# EAGLE design dist_sensor (EAGLE 7.1.0)
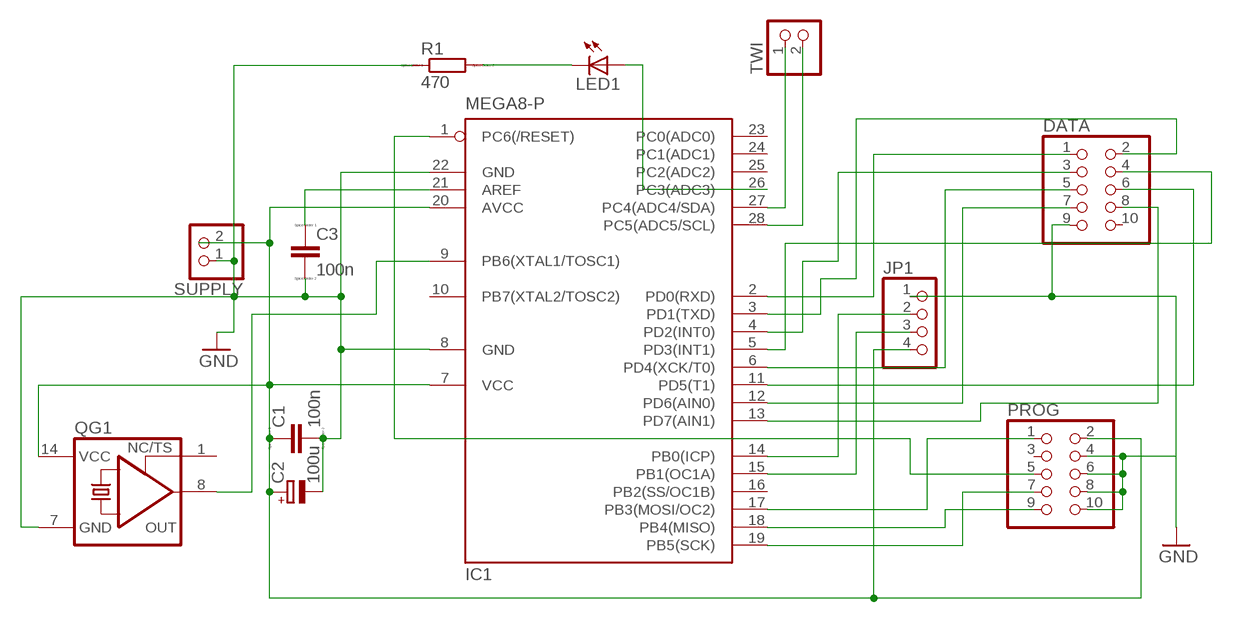
[diagram p0: schematic, sheet 1]

## Parts
C1  100n  C-EU025-025X050  [C025-025X050]
C2  100u  CPOL-EUE5-8.5  [E5-8,5]
C3  100n  C-EU025-025X050  [C025-025X050]
DATA  PINHD-2X5  [2X05]
IC1  MEGA8-P  [DIL28-3]
JP1  PINHD-1X4  [1X04]
LED1  LED5MM  [LED5MM]
PROG  PINHD-2X5  [2X05]
QG1  XO-14  [DIL14S]
R1  470  R-EU_0207_10  [0207/10]
SUPPLY  PINHD-1X2  [1X02]
TWI  PINHD-1X2  [1X02]

## Nets
GND: C1.2 C2.- C3.2 DATA.9 IC1.8(GND) IC1.22(GND) JP1.1 PROG.4 PROG.6 PROG.8 PROG.10 QG1.7(GND) R1.1 SUPPLY.1
N$1: IC1.17(PB3(MOSI/OC2)) PROG.1
N$2: IC1.18(PB4(MISO)) PROG.9
N$3: IC1.19(PB5(SCK)) PROG.7
N$4: C1.1 C2.+ IC1.7(VCC) IC1.20(AVCC) JP1.4 PROG.2 QG1.14(VCC) SUPPLY.2
N$5: IC1.1(PC6(/RESET)) PROG.5
N$6: DATA.1 IC1.2(PD0(RXD))
N$7: DATA.2 IC1.3(PD1(TXD))
N$8: IC1.27(PC4(ADC4/SDA)) TWI.1
N$9: DATA.4 IC1.5(PD3(INT1))
N$10: DATA.3 IC1.4(PD2(INT0))
N$11: DATA.5 IC1.6(PD4(XCK/T0))
N$12: DATA.6 IC1.11(PD5(T1))
N$13: DATA.8 IC1.13(PD7(AIN1))
N$14: IC1.14(PB0(ICP)) JP1.2
N$15: DATA.7 IC1.12(PD6(AIN0))
N$16: IC1.15(PB1(OC1A)) JP1.3
N$17: C3.1 IC1.21(AREF)
N$18: IC1.9(PB6(XTAL1/TOSC1)) QG1.8(OUT)
N$19: IC1.28(PC5(ADC5/SCL)) TWI.2
N$20: IC1.26(PC3(ADC3)) LED1.A
N$21: LED1.K(C) R1.2
Unconnected: DATA.10 IC1.10(PB7(XTAL2/TOSC2)) IC1.16(PB2(SS/OC1B)) IC1.23(PC0(ADC0)) IC1.24(PC1(ADC1)) IC1.25(PC2(ADC2)) PROG.3 QG1.1(TS)

## Library data of the parts
C1 C3 = resistor:C-EU: CAPACITOR, European symbol; SPICEPREFIX: C
C2 = resistor:CPOL-EU: POLARIZED CAPACITOR, European symbol
DATA PROG = pinhead:PINHD-2X5: PIN HEADER
IC1 = atmel:MEGA8-P: MICROCONTROLLER 8 Kbytes FLASH, 1 kbytes SRAM, 512 bytes EEPROM, USART, 4-channel 10 bit ADC, 2-channel 8 bit ADC Pin compatible with Atmega48, ATMega88, ATMega168 Source: avr.lbr; OC_FARNELL: unknown; OC_NEWARK: unknown
JP1 = pinhead:PINHD-1X4: PIN HEADER
LED1 = led:LED: LED OSRAM: - CHIPLED LG R971, LG N971, LY N971, LG Q971, LY Q971, LO R971, LY R971 LH N974, LH R974 LS Q976, LO Q976, LY Q976 LO Q996 - Hyper CHIPLED LW Q18S LB Q993, LB Q99A, LB R99A - SideLED LS A670, LO A670, LY A670, LG A670, LP A670 LB A673, LV A673, LT A673, LW A673 LH A674 LY A675 LS A676, LA A676, LO A676, LY A676, LW A676 LS A679, LY A679, LG A679 - Hyper Micro SIDELED® LS Y876, LA Y876, LO Y876, LY Y876 LT Y87S - SmartLED LW L88C, LW L88S LB L89C, LB L89S, LG L890 LS L89K, LO L89K, LY L89K LS L896, LA L896, LO L896, LY L896 - TOPLED LS T670, LO T670, LY T670, LG T670, LP T670 LSG T670, LSP T670, LSY T670, LOP T670, LYG T670 LG T671, LOG T671, LSG T671 LB T673, LV T673, LT T673, LW T673 LH T674 LS T676, LA T676, LO T676, LY T676, LB T676, LH T676, LSB T676, LW T676 LB T67C, LV T67C, LT T67C, LS T67K, LO T67K, LY T67K, LW E67C LS E67B, LA E67B, LO E67B, LY E67B, LB E67C, LV E67C, LT E67C LW T67C LS T679, LY T679, LG T679 LS T770, LO T770, LY T770, LG T770, LP T770 LB T773, LV T773, LT T773, LW T773 LH T774 LS E675, LA E675, LY E675, LS T675 LS T776, LA T776, LO T776, LY T776, LB T776 LHGB T686 LT T68C, LB T68C - Hyper Mini TOPLED® LB M676 - Mini TOPLED Santana® LG M470 LS M47K, LO M47K, LY M47K Source: http://www.osram.convergy.de LUXEON: - LUMILED® LXK2-PW12-R00, LXK2-PW12-S00, LXK2-PW14-U00, LXK2-PW14-V00 LXK2-PM12-R00, LXK2-PM12-S00, LXK2-PM14-U00 LXK2-PE12-Q00, LXK2-PE12-R00, LXK2-PE12-S00, LXK2-PE14-T00, LXK2-PE14-U00 LXK2-PB12-K00, LXK2-PB12-L00, LXK2-PB12-M00, LXK2-PB14-N00, LXK2-PB14-P00, LXK2-PB14-Q00 LXK2-PR12-L00, LXK2-PR12-M00, LXK2-PR14-Q00, LXK2-PR14-R00 LXK2-PD12-Q00, LXK2-PD12-R00, LXK2-PD12-S00 LXK2-PH12-R00, LXK2-PH12-S00 LXK2-PL12-P00, LXK2-PL12-Q00, LXK2-PL12-R00 Source: www.luxeon.com KINGBRIGHT: KA-3528ASYC Source: www.kingbright.com
QG1 = crystal:XO-: CRYSTAL; OC_FARNELL: unknown; OC_NEWARK: unknown
R1 = resistor:R-EU_: RESISTOR, European symbol; SPICEPREFIX: R
SUPPLY TWI = pinhead:PINHD-1X2: PIN HEADER

## Board
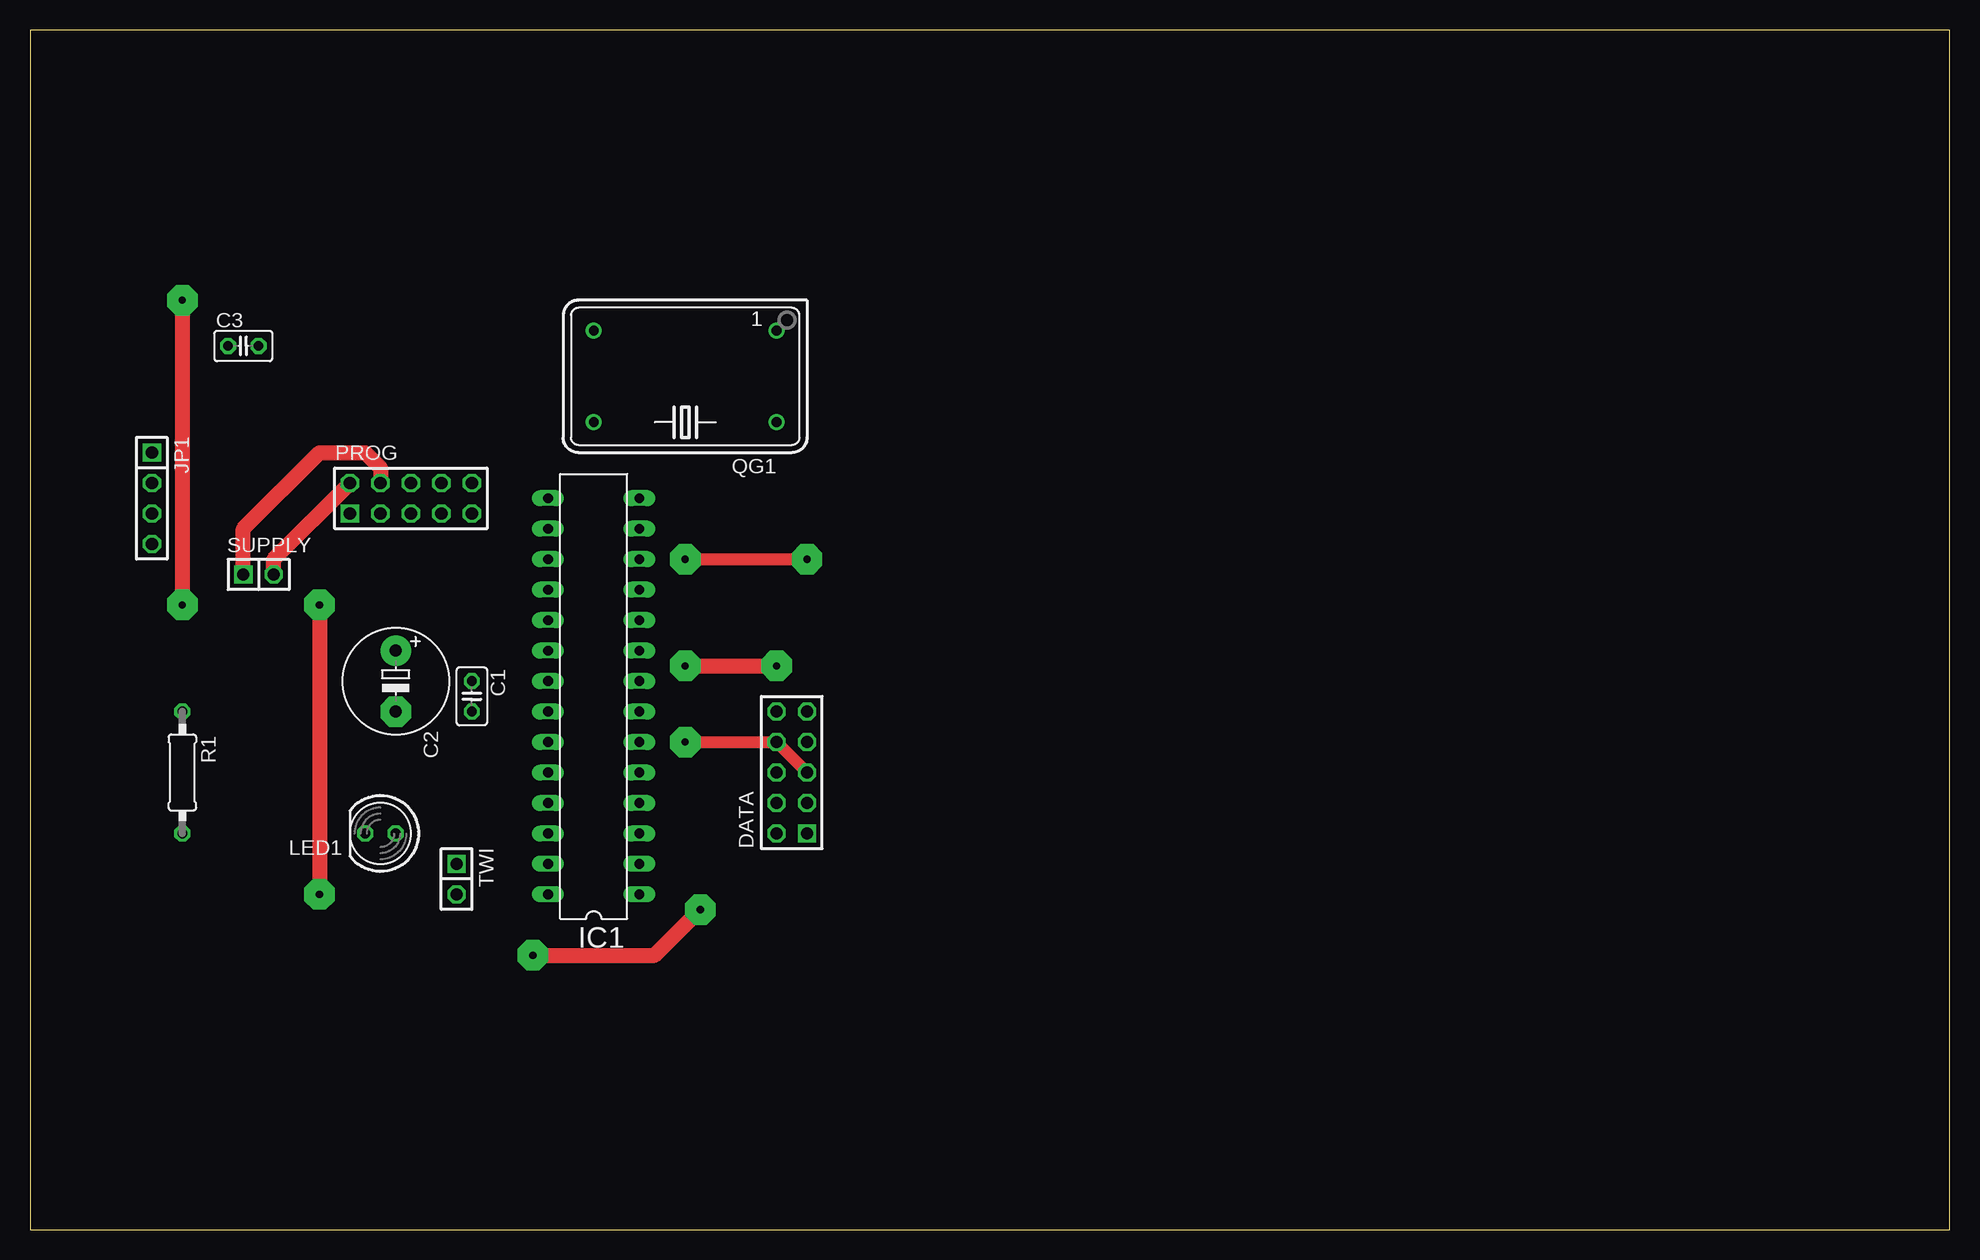
[diagram p1: board, top side]
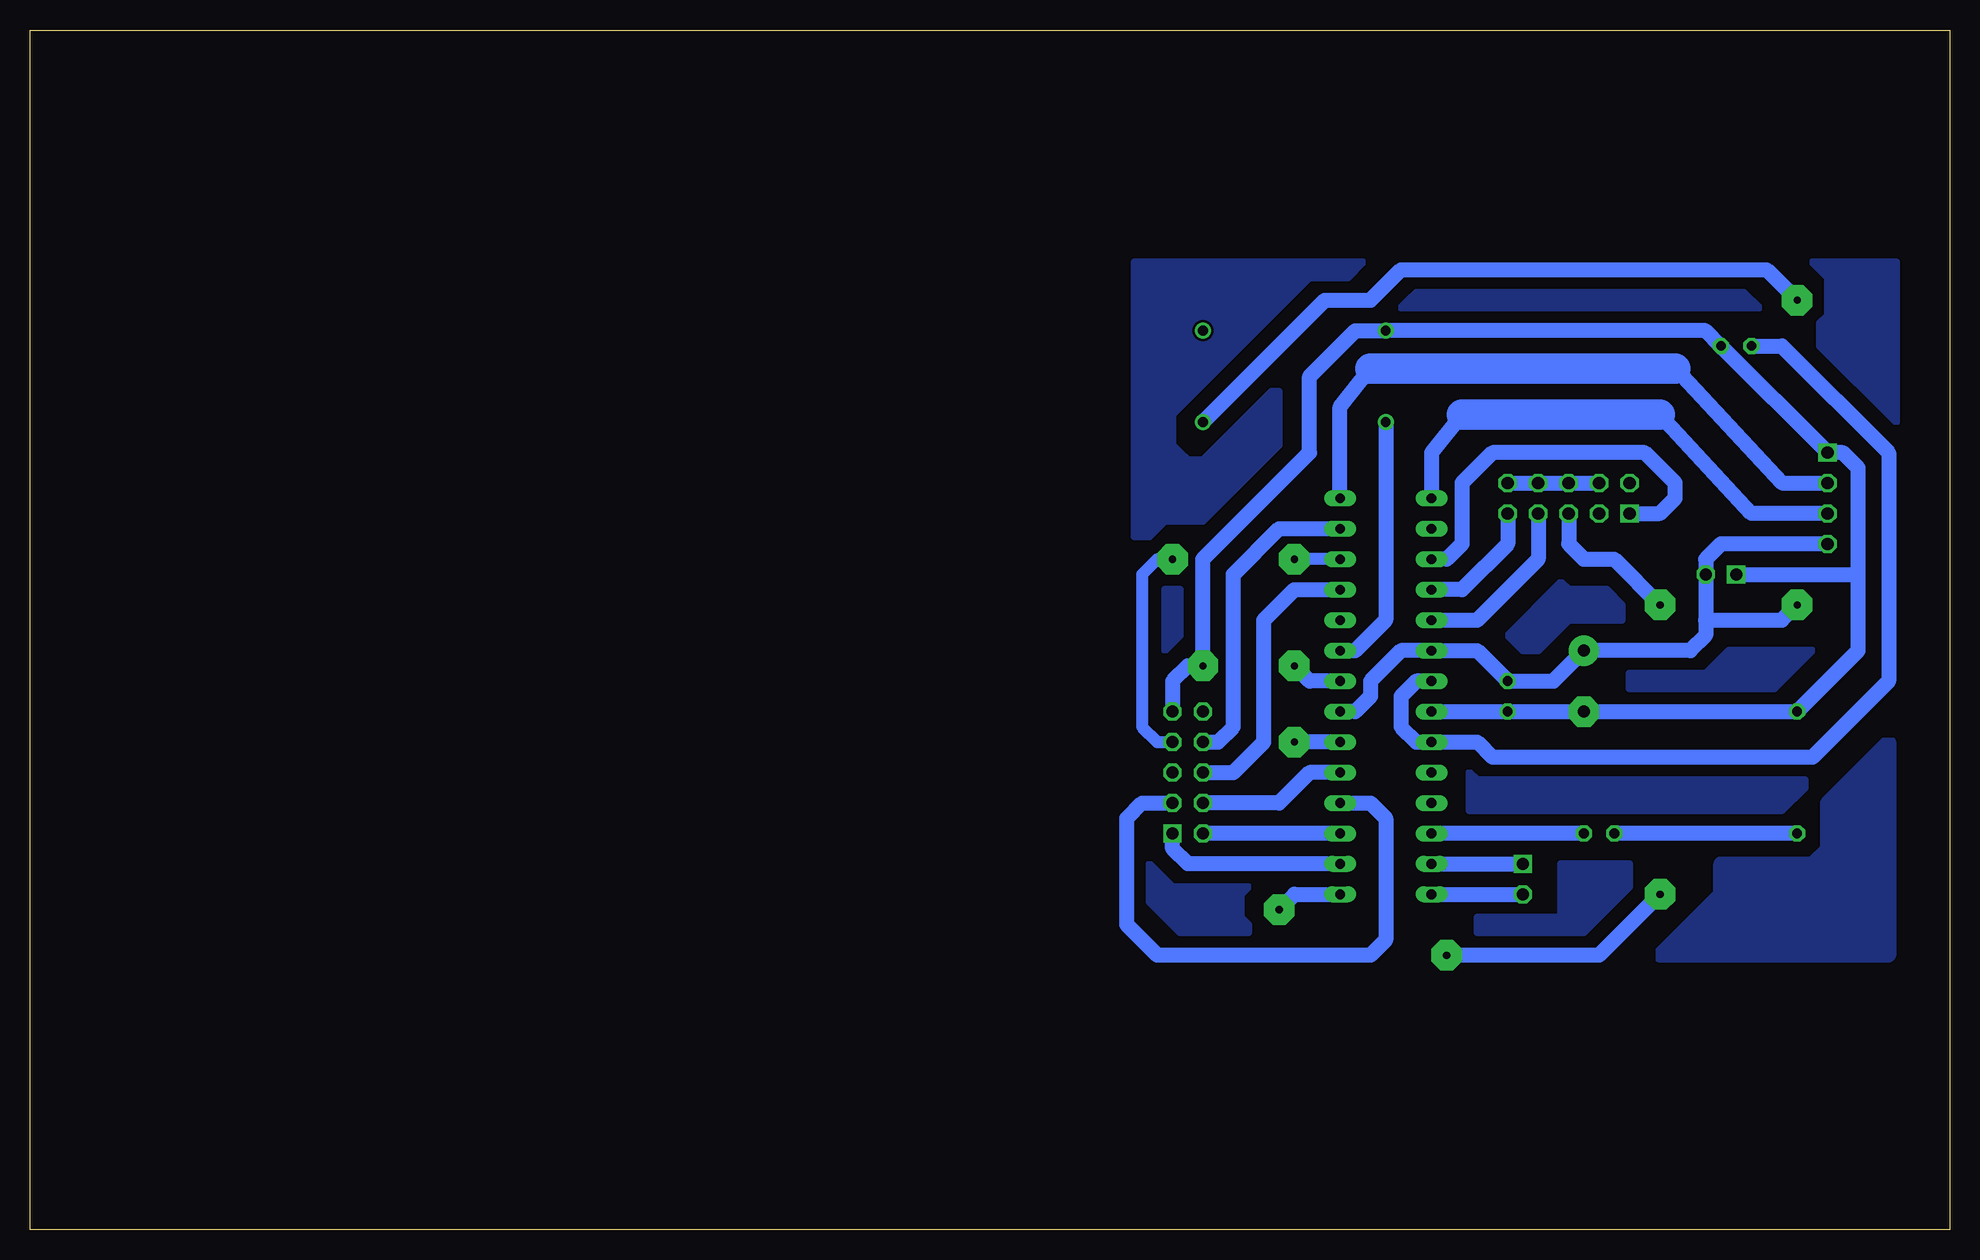
[diagram p2: board, bottom side, seen from below]

Size 160 x 100 mm. Coordinates in mm from the lower left corner, seen from the top.
Outline: 0,0 160,0 160,100 0,100 0,0
Copper layers (1*16): Top 0.035mm / dielectric 1.5mm / Bottom 0.035mm
Design rules "default": minimum track width 10mil, minimum drill 24mil, track to track 8mil, track to pad 8mil, pad to pad 8mil, via to via 8mil, smd to smd 8mil, copper to edge 40mil, drill to drill 8mil, minimum pad ring 10mil, minimum via ring 8mil, stop-mask expansion 4mil, vias tented up to drill 0mil, thermal gap 10mil

### Footprints (pad centres in the part's own frame; a part is rotated, then mirrored left to right if it is on the bottom)
C025-025X050 = drill 0.813 octagon: 1 -1.27,0; 2 1.27,0
E5-8,5 = drill 1.016 pad 2.54: + -2.54,0 | drill 1.016 pad 2.54 octagon: - 2.54,0
2X05 = drill 1.016 square: 1 -5.08,-1.27 | drill 1.016 octagon: 2 -5.08,1.27; 3 -2.54,-1.27; 4 -2.54,1.27; 5 0,-1.27; 6 0,1.27; 7 2.54,-1.27; 8 2.54,1.27; 9 5.08,-1.27; 10 5.08,1.27
DIL28-3 = drill 0.813 long: 1 -16.51,-3.81; 2 -13.97,-3.81; 3 -11.43,-3.81; 4 -8.89,-3.81; 5 -6.35,-3.81; 6 -3.81,-3.81; 7 -1.27,-3.81; 8 1.27,-3.81; 9 3.81,-3.81; 10 6.35,-3.81; 11 8.89,-3.81; 12 11.43,-3.81; 13 13.97,-3.81; 14 16.51,-3.81; 15 16.51,3.81; 16 13.97,3.81; 17 11.43,3.81; 18 8.89,3.81; 19 6.35,3.81; 20 3.81,3.81; 21 1.27,3.81; 22 -1.27,3.81; 23 -3.81,3.81; 24 -6.35,3.81; 25 -8.89,3.81; 26 -11.43,3.81; 27 -13.97,3.81; 28 -16.51,3.81
1X04 = drill 1.016 square: 1 -3.81,0 | drill 1.016 octagon: 2 -1.27,0; 3 1.27,0; 4 3.81,0
LED5MM = drill 0.813 octagon: A -1.27,0; K 1.27,0
DIL14S = drill 0.813: 1 -7.62,-3.81; 7 7.62,-3.81; 8 7.62,3.81; 14 -7.62,3.81
0207/10 = drill 0.813 octagon: 1 -5.08,0; 2 5.08,0
1X02 = drill 1.016 square: 1 -1.27,0 | drill 1.016 octagon: 2 1.27,0

### Placement (x,y rotation side)
C1  36.83,44.45 270 top
C2  30.48,45.72 270 top
C3  17.78,73.66 0 top
DATA  63.5,38.1 90 top
IC1  46.99,44.45 90 top
JP1  10.16,60.96 270 top
LED1  29.21,33.02 180 top
PROG  31.75,60.96 0 top
QG1  54.61,71.12 180 top
R1  12.7,38.1 270 top
SUPPLY  19.05,54.61 0 top
TWI  35.56,29.21 270 top

### Tracks (layer width: path | path; a pad name or v marks a point on that pad's centre or on a via)
GND  (via drill 0.6 pad 2.54)
  Top 1.27: v54.61,46.99 v62.23,46.99 | SUPPLY.1 17.78,58.42 24.13,64.77 27.94,64.77 29.21,63.5 PROG.4
  Bottom 1.27: IC1.22 C1.2 C2.- R1.1 7.62,48.26 7.62,54.61 | IC1.8 53.34,45.72 v54.61,46.99 | DATA.9 64.77,45.72 63.5,46.99 v62.23,46.99 62.23,55.88 53.34,64.77 53.34,71.12 49.53,74.93 QG1.7 20.32,74.93 C3.2 JP1.1 8.89,64.77 7.62,63.5 7.62,54.61 | SUPPLY.1 7.62,54.61 | PROG.10 PROG.8 PROG.6 PROG.4
N$1
  Bottom 1.27: PROG.1 24.13,59.69 22.86,60.96 22.86,62.23 25.4,64.77 38.1,64.77 40.64,62.23 40.64,57.15 41.91,55.88 IC1.17
N$2
  Bottom 1.27: PROG.9 36.83,57.15 40.64,53.34 IC1.18
N$3
  Bottom 1.27: IC1.19 39.37,50.8 34.29,55.88 PROG.7
N$4  (via drill 0.6 pad 2.54)
  Top 1.27: v12.7,77.47 v12.7,52.07 | SUPPLY.2 20.32,55.88 PROG.2
  Bottom 1.27: JP1.4 19.05,57.15 20.32,55.88 SUPPLY.2 20.32,50.8 | 20.32,50.8 20.32,49.53 21.59,48.26 C2.+ 33.02,45.72 C1.1 39.37,48.26 IC1.20 45.72,48.26 48.26,45.72 48.26,44.45 49.53,43.18 IC1.7 | 20.32,50.8 13.97,50.8 v12.7,52.07 | QG1.14 52.07,77.47 48.26,77.47 45.72,80.01 15.24,80.01 v12.7,77.47
N$5  (via drill 0.6 pad 2.54)
  Top 1.27: v24.13,52.07 v24.13,27.94 | v41.91,22.86 52.07,22.86 v55.88,26.67
  Bottom 1.27: PROG.5 31.75,57.15 30.48,55.88 27.94,55.88 v24.13,52.07 | v24.13,27.94 29.21,22.86 v41.91,22.86 | v55.88,26.67 54.61,27.94 IC1.1
N$6
  Bottom 1.27: IC1.2 63.5,30.48 64.77,31.75 DATA.1
N$7
  Bottom 1.27: IC1.3 DATA.2
N$8
  Bottom 1.27: IC1.27 TWI.1
N$9
  Bottom 1.27: IC1.5 53.34,38.1 55.88,35.56 DATA.4
N$10
  Bottom 1.27: IC1.4 48.26,35.56 46.99,34.29 46.99,24.13 48.26,22.86 66.04,22.86 68.58,25.4 68.58,34.29 67.31,35.56 DATA.3
N$11  (via drill 0.6 pad 2.54)
  Top 1.016: v54.61,40.64 62.23,40.64 DATA.5
  Bottom 1.27: IC1.6 v54.61,40.64
N$12
  Bottom 1.27: DATA.6 59.69,38.1 57.15,40.64 57.15,50.8 54.61,53.34 IC1.11
N$13
  Bottom 1.27: DATA.8 60.96,40.64 59.69,41.91 59.69,54.61 55.88,58.42 IC1.13
N$14
  Bottom 1.27: IC1.14 50.8,68.58 48.26,71.75 | 22.86,71.75 13.97,62.23 JP1.2
  Bottom 2.54: 48.26,71.75 22.86,71.75
N$15  (via drill 0.6 pad 2.54)
  Top 1.016: v54.61,55.88 v64.77,55.88
  Bottom 1.016: IC1.12 v54.61,55.88 | v64.77,55.88 66.04,55.88 67.31,54.61 67.31,41.91 66.04,40.64 DATA.7
N$16
  Bottom 1.27: JP1.3 16.51,59.69 24.13,67.94 | 40.64,67.94 43.18,64.77 IC1.15
  Bottom 2.54: 24.13,67.94 40.64,67.94
N$17
  Bottom 1.27: C3.1 13.97,73.66 5.08,64.77 5.08,45.72 11.43,39.37 38.1,39.37 39.37,40.64 44.45,40.64 45.72,41.91 45.72,44.45 44.45,45.72 IC1.21
N$18
  Bottom 1.27: QG1.8 46.99,50.8 49.53,48.26 IC1.9
N$19
  Bottom 1.27: IC1.28 TWI.2
N$20
  Bottom 1.27: LED1.A IC1.26
N$21
  Bottom 1.27: R1.2 LED1.K
N$22
  pour Bottom: 5.08,40.64 5.08,22.86 24.13,22.86 19.05,27.94 19.05,30.48 11.43,30.48 10.16,31.75 10.16,35.56
N$23
  pour Bottom: 28.57,53.34 31.75,53.34 32.38,53.98 36.83,49.53 35.56,48.26 34.29,48.26 31.75,50.8 27.3,50.8 27.3,52.07
N$24
  pour Bottom: 11.43,48.26 18.41,48.26 20.32,46.35 26.67,46.35 26.67,45.09 14.61,45.09
N$25
  pour Bottom: 8.26,80.64 4.45,80.64 4.45,67.31 10.79,73.66 10.79,75.56 10.16,76.2 10.16,78.74 10.16,79.38 11.43,80.64
N$26
  pour Bottom: 50.8,80.64 67.94,80.64 67.94,57.78 66.67,57.78 65.41,59.05 62.23,59.05 55.88,65.41 55.88,69.85 56.52,69.85 62.23,64.14 63.5,64.14 64.14,64.77 64.77,65.41 64.77,67.94 53.34,79.38 50.16,79.38 48.9,80.64
N$27
  pour Bottom: 17.14,78.11 44.45,78.11 45.09,77.47 45.72,76.83 15.88,76.83
N$28
  pour Bottom: 59.69,28.57 64.77,28.57 66.67,30.48 66.67,27.3 64.14,24.77 58.42,24.77 58.42,25.4 59.05,26.04 59.05,27.94 58.42,28.57
N$29
  pour Bottom: 27.3,30.48 32.38,30.48 32.38,26.04 39.37,26.04 39.37,24.77 30.48,24.77 26.67,28.57 26.67,30.48
N$30
  pour Bottom: 12.7,37.47 39.37,37.47 40.01,38.1 40.01,35.56 40.01,34.92 13.97,34.92 12.06,36.83 12.06,37.47
N$31
  pour Bottom: 64.14,53.34 64.14,49.53 65.41,48.26 65.41,53.34